# Altium schematic sheet LCD.SchDoc
size A4
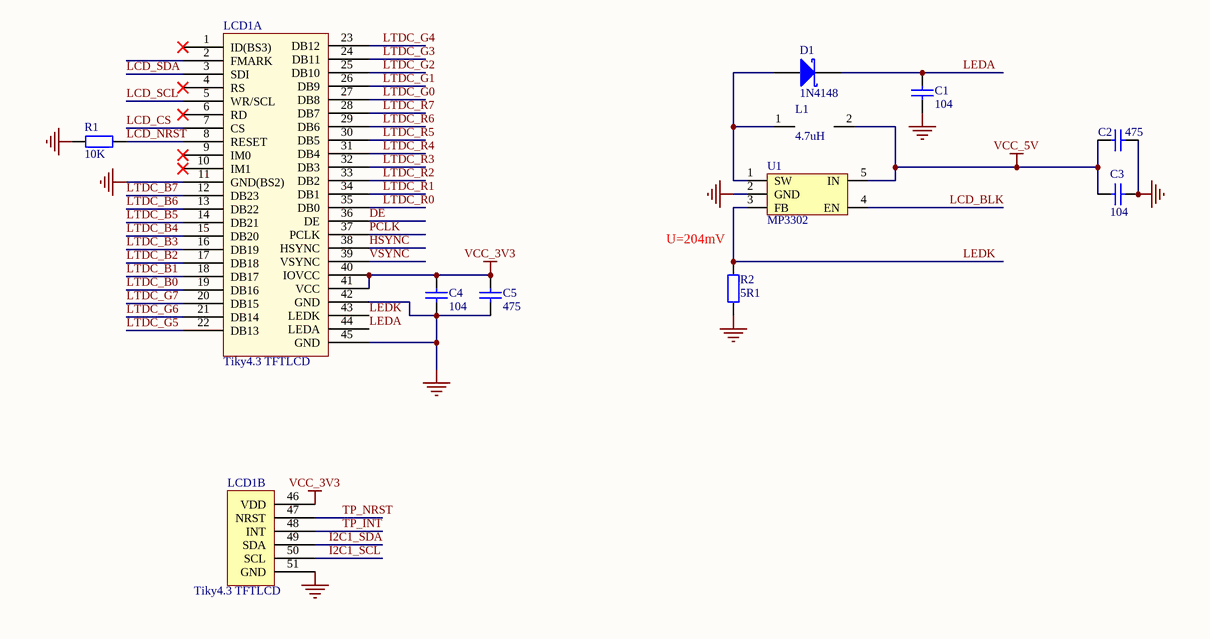
[diagram p0: LCD.SchDoc]

## Parts
C1  104  [C0402_M]
C2  475  [C0402_M]
C3  104  [C0402_M]
C4  104  [C0402_M]
C5  475  [C0402_M]
D1  1N4148  [SOD-123]
L1  4.7uH  [L1206]
LCD1  Tiky4.3 TFTLCD  [Tiky 4.3 TFTLCD]  (parts A,B of 2)
R1  10K  [R0402_M]
R2  5R1  [R0603_M]
U1  MP3302  [SOT23-5]

## Nets
GND: C1.2 C2.1 C3.2 C4.2 C5.2 LCD1.11(GND(BS2)) LCD1.42(GND) LCD1.45(GND) LCD1.51(GND) R1.1 R2.2 U1.2(GND)
VCC_3V3: C4.1 C5.1 LCD1.40(IOVCC) LCD1.41(VCC) LCD1.46(VDD)
VCC_5V: C2.2 C3.1 L1.2 U1.5(IN)
DE: LCD1.36(DE)
HSYNC: LCD1.38(HSYNC)
I2C1_SCL: LCD1.50(SCL)
I2C1_SDA: LCD1.49(SDA)
LCD_BLK: U1.4(EN)
LCD_CS: LCD1.7(CS)
LCD_NRST: LCD1.8(RESET) R1.2
LCD_SCL: LCD1.5(WR/SCL)
LCD_SDA: LCD1.3(SDI)
LEDA: C1.1 D1.2(K) LCD1.44(LEDA)
LEDK: LCD1.43(LEDK) R2.1 U1.3(FB)
LTDC_B0: LCD1.19(DB16)
LTDC_B1: LCD1.18(DB17)
LTDC_B2: LCD1.17(DB18)
LTDC_B3: LCD1.16(DB19)
LTDC_B4: LCD1.15(DB20)
LTDC_B5: LCD1.14(DB21)
LTDC_B6: LCD1.13(DB22)
LTDC_B7: LCD1.12(DB23)
LTDC_G0: LCD1.27(DB8)
LTDC_G1: LCD1.26(DB9)
LTDC_G2: LCD1.25(DB10)
LTDC_G3: LCD1.24(DB11)
LTDC_G4: LCD1.23(DB12)
LTDC_G5: LCD1.22(DB13)
LTDC_G6: LCD1.21(DB14)
LTDC_G7: LCD1.20(DB15)
LTDC_R0: LCD1.35(DB0)
LTDC_R1: LCD1.34(DB1)
LTDC_R2: LCD1.33(DB2)
LTDC_R3: LCD1.32(DB3)
LTDC_R4: LCD1.31(DB4)
LTDC_R5: LCD1.30(DB5)
LTDC_R6: LCD1.29(DB6)
LTDC_R7: LCD1.28(DB7)
PCLK: LCD1.37(PCLK)
TP_INT: LCD1.48(INT)
TP_NRST: LCD1.47(NRST)
VSYNC: LCD1.39(VSYNC)
NetD1_1: D1.1(A) L1.1 U1.1(SW)

Not connected (* = marked no-connect by the designer): LCD1 1(ID(BS3))* 2(FMARK) 4(RS)* 6(RD)* 9(IM0)* 10(IM1)*

## Notes on the sheet
- (near R2) U=204mV

## Library data of the parts
C1-C5 = C: 贴片电容/MLCC电容; BOM名称: 无极性贴片电容; 联系卖家，免费查找封装: 唯一出售店铺网址https://shop463601444.taobao.com
D1 = D Schottky: Schottky Diode; Published: 8-Jun-2000; LatestRevisionDate: 17-Jul-2002; LatestRevisionNote: Re-released for DXP Platform.; PackageReference: SMB; Publisher: Altium Limited; PackageDescription: DO-214-AA/SMB; 2 C-Bend Leads; Body 5.3 x 3.6 mm, inc. leads (LxW); Code_JEDEC: DO-214-AA
L1 = Inductor
R1 R2 = R: 贴片电阻; 联系卖家，免费查找封装: 唯一出售店铺网址https://shop463601444.taobao.com; BOM名称: 贴片电阻